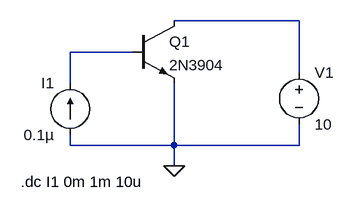
[diagram p0: schematic HLab01_BJT_xtics_A.asc]
HLab01_BJT_xtics_A.asc, the LTspice schematic file:
Version 4
SHEET 1 880 680
WIRE 384 48 192 48
WIRE 128 96 32 96
WIRE 384 128 384 48
WIRE 32 144 32 96
WIRE 32 240 32 224
WIRE 192 240 192 144
WIRE 192 240 32 240
WIRE 384 240 384 208
WIRE 384 240 192 240
WIRE 192 272 192 240
FLAG 192 272 0
SYMBOL voltage 384 112 R0
WINDOW 123 0 0 Left 0
WINDOW 39 0 0 Left 0
SYMATTR InstName V1
SYMATTR Value 10
SYMBOL npn 128 48 R0
SYMATTR InstName Q1
SYMATTR Value 2N3904
SYMBOL current 32 224 R180
WINDOW 0 24 80 Left 2
WINDOW 3 24 0 Left 2
WINDOW 123 0 0 Left 0
WINDOW 39 0 0 Left 0
SYMATTR InstName I1
SYMATTR Value 0.1µ
TEXT -44 296 Left 2 !.dc I1 0m 1m 10u

The netlist it stands for:
* HLab01_BJT_xtics_A.asc
V1 N001 0 10
Q1 N001 N002 0 0 2N3904
I1 0 N002 0.1µ
.model NPN NPN
.model PNP PNP
.lib standard.bjt
.dc I1 0m 1m 10u
.backanno
.end

* Results of the author's LTspice run, read from the files saved beside the schematic
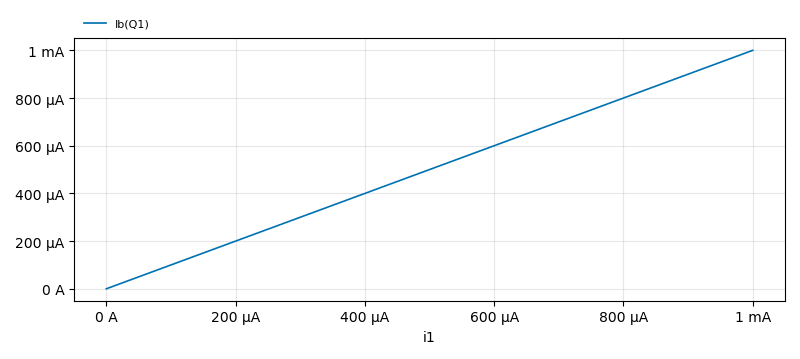
[diagram p1: DC transfer characteristic of HLab01_BJT_xtics_A.asc, plotted from the saved traces]
* DC transfer characteristic, 1 run:
*   Ib(Q1): 0 A at i1=0 A, 1 mA at i1=1 mA, min 0 A, max 1 mA